# Altium schematic sheet MCU.SchDoc
size A; SheetNumber: 2; SheetTotal: 6
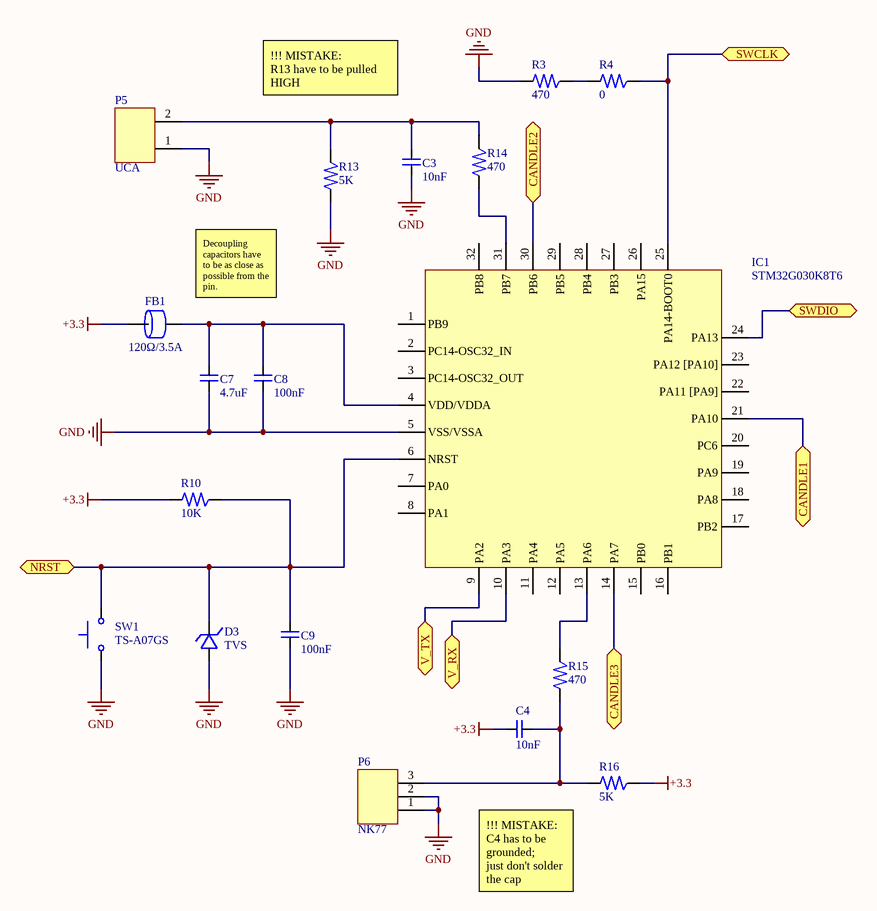
[diagram p0: MCU.SchDoc]

## Parts
C3  10nF  [SMT_CAP_0805(2012)_X5R-KYOCERA]
C4  10nF  [SMT_CAP_0805(2012)_X5R-KYOCERA]
C7  4.7uF  [SMT_CAP_1206(3216)_MLCC-KEMET]
C8  100nF  [SMT_CAP_0805(2012)_MLCC-KYOCERA]
C9  100nF  [SMT_CAP_0805(2012)_X5R-KYOCERA]
D3  TVS  [SMT_DIODE_TVS_SOD-323]
FB1  120Ω/3.5A  [SMT_FERR_BEAD_MODEL_1206(3216)_MURATA]
IC1  STM32G030K8T6  [SMT_STM32G030K8T6_IC]
P5  UCA  [THT_CON_WAFER_2P_2317SJ-02-K0]
P6  NK77  [THT_CON_WAFER_3P_2317SJ-03-K0]
R3  470  [SMT_RES_0805(2012)]
R4  0  [SMT_RES_0805(2012)]
R10  10K  [SMT_RES_0805(2012)]
R13  5K  [SMT_RES_0805(2012)]
R14  470  [SMT_RES_0805(2012)]
R15  470  [SMT_RES_0805(2012)]
R16  5K  [SMT_RES_0805(2012)]
SW1  TS-A07GS  [SMT_TSW-A07GS]

## Ports
CANDLE1 (bidir), CANDLE2 (bidir), CANDLE3 (bidir), NRST (bidir), SWCLK (bidir), SWDIO (bidir), V_RX (bidir), V_TX (bidir)

## Nets
+3.3: C4.2 FB1.1 R10.1 R16.2
GND: C3.2 C7.1 C8.2 C9.1 D3.2 IC1.5(VSS/VSSA) P5.1 P6.1(PB9) P6.2(PB10) R3.1 R13.1 SW1.1
CANDLE1: IC1.21(PA10) ; port CANDLE1
CANDLE2: IC1.30(PB6) ; port CANDLE2
CANDLE3: IC1.14(PA7) ; port CANDLE3
NRST: C9.2 D3.1 IC1.6(NRST) R10.2 SW1.2 ; port NRST
SWCLK: IC1.25(PA14-BOOT0) R4.2 ; port SWCLK
SWDIO: IC1.24(PA13) ; port SWDIO
V_RX: IC1.10(PA3) ; port V_RX
V_TX: IC1.9(PA2) ; port V_TX
NetC3_1: C3.1 P5.2 R13.2 R14.2
NetC4_1: C4.1 P6.3(PB11) R15.1 R16.1
NetC7_2: C7.2 C8.1 FB1.2 IC1.4(VDD/VDDA)
NetIC1_13: IC1.13(PA6) R15.2
NetIC1_31: IC1.31(PB7) R14.1
NetR3_2: R3.2 R4.1

Not connected (* = marked no-connect by the designer): IC1 1(PB9) 2(PC14-OSC32_IN) 3(PC14-OSC32_OUT) 7(PA0) 8(PA1) 11(PA4) 12(PA5) 15(PB0) 16(PB1) 17(PB2) 18(PA8) 19(PA9) 20(PC6) 22(PA11_[PA9]) 23(PA12_[PA10]) 26(PA15) 27(PB3) 28(PB4) 29(PB5) 32(PB8)

## Notes on the sheet
- !!! MISTAKE:
  R13 have to be pulled HIGH
- (near FB1) Decoupling capacitors have to be as close as possible from the pin.
- (near R16) !!! MISTAKE:
  C4 has to be grounded;
  just don't solder the cap

## Library data of the parts
C3 C4 C9 = SMT_CAP_0805(2012)_X5R-KYOCERA: Multilayer Ceramic Capacitor 0805(2012) KYOCERA AVX 100nF 08055D104KAT2A 50VDC X5R
C7 = SMT_CAP_1206(3216)_MLCC-KEMET: Multilayer Ceramic Capacitor MLCC 1206(3216) KEMET(Yageo) 4.7uF C1206C475K5RACTU 50VDC X7R
C8 = SMT_CAP_0805(2012)_MLCC-KYOCERA: Multilayer Ceramic Capacitor MLCC 1206(3216) KYOCERA AVX 100nF 08055C104JAT2A 50VDC X7R
D3 = SMT_DIODE_TVS_SOD-323: Diode TVS Semtech Vwr=3.3V Vcl=15.7 ESD=30kV Ip=36A RCLAMP03301H.C
FB1 = SMT_FERR_BEAD_MODEL_1206(3216)_MURATA: SMT MURATA Ferrite Bead MODEL 1206(3216) BLM31PG121SN1L *Ω/*mA
IC1 = SMT_STM32G030K8T6_IC: STM32G030K8T6 Cortex-M0+ Flash=64Kbytes RAM=8Kbyte LQFP-32
P5 = THT_CON_WAFER_2P_2317SJ-02-K0: Connector Wafer 2-Pins Pitch-2.5mm Straight_Pins NELTRON 2317SJ-02-K0
P6 = THT_CON_WAFER_3P_2317SJ-03-K0: Connector Wafer 3-Pins Pitch-2.5mm Straight_Pins NELTRON 2317SJ-03-K0
R3 R4 R10 R13-R16 = SMT_RES_0805(2012): 0805(2012) Resistor 1/4-1/8W 150V 2A
SW1 = SMT_TSW-A07GS: Tactile Switch TS-A07GS 50mA 12V